# Altium schematic sheet 2-Power.SchDoc
size A4
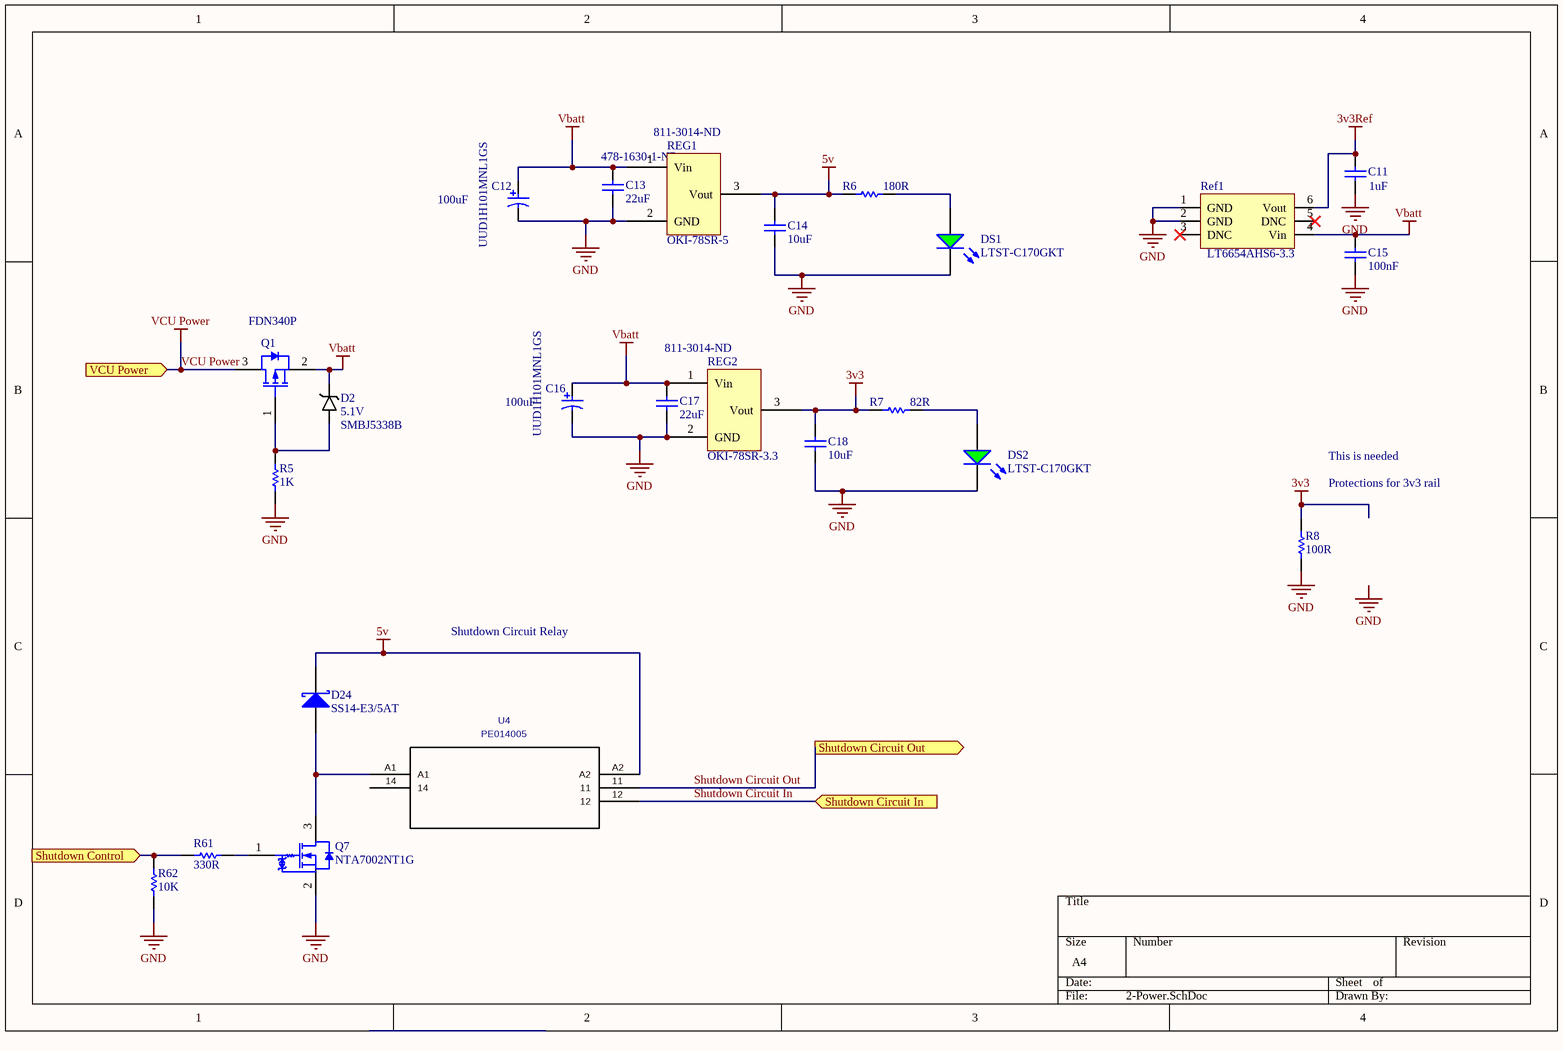
[diagram p0: 2-Power.SchDoc]

## Parts
C11  value 1uF  [1608[0603]]  (hidden comment: Cap)
C12  UUD1H101MNL1GS  [NIC-CAPA2-8X10_V]
C13  value 22uF  Supplier Part Number 1: 478-1630-1-ND  [C1210_M]  (hidden comment: Cap)
C14  value 10uF  [C1210_M]  (hidden comment: Cap)
C15  value 100nF  [1608[0603]]  (hidden comment: Cap)
C16  UUD1H101MNL1GS  [NIC-CAPA2-8X10_V]
C17  value 22uF  [C1210_M]  (hidden comment: Cap)
C18  value 10uF  [C1210_M]  (hidden comment: Cap)
D2  Reverse Voltage: 5.1V  Part Number: SMBJ5338B  [DO-214AA (SMB)]  (hidden comment: Zener Diode, 5.1V, 5W SMBJ5338B)
D24  SS14-E3/5AT  [VISH-DO-214AC-2_V]
DS1  LTST-C170GKT  [LTST-C170GKT_V]
DS2  LTST-C170GKT  [LTST-C170GKT_V]
Q1  FDN340P  [FAIR-SSOT3L-3_V]
Q7  NTA7002NT1G  [ONSC-SC-75-3-463-01_V]
R5  value 1K  [1608[0603]]  (hidden comment: Res1)
R6  value 180R  [1608[0603]]  (hidden comment: Res1)
R7  value 82R  [1608[0603]]  (hidden comment: Res1)
R8  100R  [RESC1206(3216)_M]
R61  value 330R  [1608[0603]]  (hidden comment: Res1)
R62  value 10K  [1608[0603]]  (hidden comment: Res1)
Ref1  LT6654AHS6-3.3  [TSOT-23 S6]
REG1  OKI-78SR-5  Supplier Part Number 2: 811-3014-ND  [OKI-78SR-5/1.5-W - Horizontal]
REG2  OKI-78SR-3.3  Supplier Part Number 2: 811-3014-ND  [Reg - TH, 3 pin, 100 mil Pitch, VTL]
U4  PE014005  [PE014005]

## Ports
Shutdown Circuit In (in), Shutdown Circuit Out (out), Shutdown Control (in), VCU Power (in)

## Nets
3v3: C18.2 R7.1 R8.2 REG2.3(Vout)
3v3Ref: C11.2 Ref1.6(Vout)
5v: C14.2 D24.2(K) R6.1 REG1.3(Vout) U4.A2
GND: C11.1 C12.2 C13.1 C14.1 C15.1 C16.2 C17.1 C18.1 DS1.2(K) DS2.2(K) Q7.2(S) R5.1 R8.1 R62.1 Ref1.1(GND) Ref1.2(GND) REG1.2(GND) REG2.2(GND)
Vbatt: C12.1 C13.2 C15.2 C16.1 C17.2 D2.K Q1.2(SOURCE) Ref1.4(Vin) REG1.1(Vin) REG2.1(Vin)
VCU Power: Q1.3(DRAIN) ; port VCU Power
Shutdown Circuit In: U4.12 ; port Shutdown Circuit In
Shutdown Circuit Out: U4.11 ; port Shutdown Circuit Out
Shutdown Control: R61.2 R62.2 ; port Shutdown Control
NetD2_A: D2.A Q1.1(GATE) R5.2
NetD24_1: D24.1(A) Q7.3(D) U4.A1
NetDS1_1: DS1.1(A) R6.2
NetDS2_1: DS2.1(A) R7.2
NetQ7_1: Q7.1(G) R61.1

Not connected (* = marked no-connect by the designer): Ref1 3(DNC)* 5(DNC)*; U4 14

## Notes on the sheet
- (near C12) 100uF
- (near C16) 100uF
- (near R8) Protections for 3v3 rail
- This is needed
- Shutdown Circuit Relay
- Labels drawn without touching a wire or pin: GND

## Library data of the parts
C11 = Cap: Capacitor; Manufacturer: Murata Electronics North America; Manufacturer Part Number: GRM188R61E105KA12D; Capacitance: 1µF; Tolerance: ±10%; Voltage - Rated: 25V; Temperature Coefficient: X5R; RoHS: RoHS Compliant; Category: Capacitors; Stock 1: 4259407; Pricing 1: 1=0.15, 10=0.053, 50=0.0288, 100=0.0242, 250=0.01984, 500=0.01696, 1000=0.0132 (CAD); Packaging: Cut Tape (CT); Part Status: Active; Operating Temperature: -55°C ~ 85°C; Features: -; Ratings: -; Applications: General Purpose; Mounting Type: Surface Mount, MLCC; Package / Case: 0603 (1608 Metric); Size / Dimension: 0.063" L x 0.031" W (1.60mm x 0.80mm); Height - Seated (Max): -; Thickness (Max): 0.035" (0.90mm); Lead Spacing: -; Lead Style: -; ComponentLink1URL: http://www.murata.com/~/media/webrenewal/support/library/catalog/products/capacitor/mlcc/c02e.pdf; ComponentLink1Description: http://www.murata.com/~/media/webrenewal/support/library/catalog/products/capacitor/mlcc/c02e.pdf; Supplier 1: Digi-Key; Supplier Part Number 1: 587-2400-1-ND
C12 C16 = CMP-0687-00073-1: Aluminum Electrolytic Capacitor, UD Series, Low Impedance, 100 uF, 50 V, + / - 20%, -55 to 105 degC, Chip Type, 8 x 10 mm D x L, Pb-Free, Reel; Manufacturer: Nichicon; Rated Ripple Current (at 100kHz): 300 mA; Tolerance Rated Capacitance: -20 to 20%; Packing: Dia382mm Reel; Impedance: 0.34 Ohm; Rated Voltage: 50 V; Endurance Time: 5000 h; Rated Capacitance: 100 uF; Capacitance: 100µF; Voltage Rating: 50V; Lifetime @ Temp.: 5000 Hrs @ 105°C; Polarization: Polar; Ripple Current: 300mA; Surface Mount Land Size: 0.327" L x 0.327" W (8.30mm x 8.30mm); ComponentLink3Description: Package Specification; ComponentLink2Description: Datasheet; PackageReference: CAPAE-D8H10; RoHS: TRUE; Length: 10 mm; Mounting Technology: Surface Mount; PackageDescription: 2-Pin Surface Mount Device, Diameter 8 mm, Height 10 mm, Pitch 6.5 mm; DatasheetVersion: 08/2012; Diameter: 8 mm; ComponentLink3URL: http://products.nichicon.co.jp/en/pdf/XJA043/e-ud.pdf; ComponentLink1Description: Manufacturer URL; PartNumber: UUD1H101MNL1GS; ComponentLink2URL: http://products.nichicon.co.jp/en/pdf/XJA043/e-ud.pdf; ComponentLink1URL: http://www.nichicon.co.jp/; Supplier 1: Digi-Key; Supplier Part Number 1: 493-2306-1-ND; Manufacturer Part Number: UUD1H101MNL1GS; Category: Capacitors; Stock 1: 65948; Pricing 1: 1=0.92, 10=0.685, 25=0.5868, 50=0.5478, 100=0.4696, 250=0.43044 (CAD); Packaging: Cut Tape (CT); Part Status: Active; Tolerance: ±20%; ESR (Equivalent Series Resistance): -; Operating Temperature: -55°C ~ 105°C; Applications: General Purpose; Lead Spacing: -; Size / Dimension: 0.315" Dia (8.00mm); Height - Seated (Max): 0.394" (10.00mm); Mounting Type: Surface Mount; Package / Case: Radial, Can - SMD; ComponentLink4URL: http://nichicon-us.com/english/products/pdfs/e-uud.pdf; ComponentLink4Description: http://nichicon-us.com/english/products/pdfs/e-uud.pdf
C13 C17 = Cap: Capacitor; Manufacturer: Yageo; Manufacturer Part Number: CC1210MKX5R8BB226; Capacitance: 22µF; Tolerance: ±20%; Voltage - Rated: 25V; Temperature Coefficient: X5R; RoHS: RoHS Compliant; Category: Capacitors; Stock 1: 128; Pricing 1: 1=1, 10=0.703, 25=0.5996, 50=0.5314, 100=0.4628, 250=0.39424 (CAD); Packaging: Cut Tape (CT); Part Status: Active; Operating Temperature: -55°C ~ 85°C; Features: -; Ratings: -; Applications: General Purpose; Failure Rate: -; Mounting Type: Surface Mount, MLCC; Package / Case: 1210 (3225 Metric); Size / Dimension: 0.126" L x 0.098" W (3.20mm x 2.50mm); Height - Seated (Max): -; Thickness (Max): 0.110" (2.80mm); Lead Spacing: -; Lead Style: -; ComponentLink1URL: http://www.yageo.com/documents/recent/UPY-GPHC_X5R_4V-to-50V_23.pdf; ComponentLink1Description: http://www.yageo.com/documents/recent/UPY-GPHC_X5R_4V-to-50V_23.pdf; Supplier 1: Digi-Key
  C17: Supplier Part Number 1: 311-2056-1-ND
C14 C18 = Cap: Capacitor; Manufacturer: Yageo; Manufacturer Part Number: CC1210ZKY5V8BB106; Capacitance: 10µF; Tolerance: -20%, +80%; Voltage - Rated: 25V; Temperature Coefficient: Y5V (F); Supplier 1: Digi-Key; Supplier Part Number 1: 311-2063-1-ND; RoHS: RoHS Compliant; Category: Capacitors; Stock 1: 1156; Pricing 1: 1=0.47, 10=0.323, 25=0.258, 50=0.2154, 100=0.1829, 250=0.14528, 500=0.12912, 1000=0.11298 (CAD); Packaging: Cut Tape (CT); Part Status: Active; Operating Temperature: -30°C ~ 85°C; Features: -; Ratings: -; Applications: General Purpose; Failure Rate: -; Mounting Type: Surface Mount, MLCC; Package / Case: 1210 (3225 Metric); Size / Dimension: 0.126" L x 0.098" W (3.20mm x 2.50mm); Height - Seated (Max): -; Thickness (Max): 0.083" (2.10mm); Lead Spacing: -; Lead Style: -; ComponentLink1URL: http://www.yageo.com/documents/recent/UPY-GPHC_Y5V_6.3V-to-50V_7.pdf; ComponentLink1Description: http://www.yageo.com/documents/recent/UPY-GPHC_Y5V_6.3V-to-50V_7.pdf
C15 = Cap: Capacitor; Manufacturer: Yageo; Manufacturer Part Number: CC0603KRX7R9BB104; Capacitance: 0.10µF; Tolerance: ±10%; Voltage - Rated: 50V; Temperature Coefficient: X7R; Supplier 1: Digi-Key; Supplier Part Number 1: 311-1344-1-ND; RoHS: RoHS Compliant; Category: Capacitors; Stock 1: 4016262; Pricing 1: 1=0.15, 10=0.043, 25=0.0312, 50=0.0232, 100=0.0189, 250=0.0158, 500=0.01346, 1000=0.01059 (CAD); Packaging: Cut Tape (CT); Part Status: Active; Operating Temperature: -55°C ~ 125°C; Features: -; Ratings: -; Applications: General Purpose; Failure Rate: -; Mounting Type: Surface Mount, MLCC; Package / Case: 0603 (1608 Metric); Size / Dimension: 0.063" L x 0.031" W (1.60mm x 0.80mm); Height - Seated (Max): -; Thickness (Max): 0.035" (0.90mm); Lead Spacing: -; Lead Style: -; ComponentLink1URL: http://www.yageo.com/documents/recent/UPY-GPHC_X7R_6.3V-to-50V_16.pdf; ComponentLink1Description: http://www.yageo.com/documents/recent/UPY-GPHC_X7R_6.3V-to-50V_16.pdf
D24 = CMP-0549-00004-1: Schottky Barrier Rectifier, 40 V Maximum DC Blocking Voltage, -65 to 125 degC, 2-Pin SMA Case, RoHS; Manufacturer: Vishay Semiconductor; IFSM: 40 A; IF(AV): 1 A Max.; VRRM: 40 V Max.; VRMS: 28 V Max.; PackageReference: DO-214AC-2; RoHS: TRUE; DatasheetVersion: 12/17/2012; ComponentLink1Description: Manufacturer URL; ComponentLink2URL: http://www.vishay.com/docs/88746/ss12.pdf; PartNumber: SS14-E3/5AT; PackageVersion: Dec-12; Operating Temperature: -65 to 125 degC; ComponentLink3URL: http://www.vishay.com/docs/88746/ss12.pdf; PackageDescription: 2-Pin SMD, Body 4.245 x 2.665 mm, Height 2.29 mm; ComponentLink1URL: http://www.vishay.com/; ComponentLink3Description: Package Specification; ComponentLink2Description: Datasheet; Mounting Technology: Surface Mount; VDC: 40 V Max.
DS1 DS2 = CMP-1674-00002-5: LED Uni-Color Green, 100 mW, 120 mA, -55 to 85 degC, 2-Pin SMD, RoHS, Tape and Reel; Manufacturer: Lite-On; Lens Color: Colorless; Lens Transparency: Clear; Millicandela Rating: 6mcd; Lens Style/Size: Rectangle with Flat Top, 1.40mm x 1.25mm; Voltage - Forward (Vf) (Typ): 2.1V; Current - Test: 10mA; Viewing Angle: 130°; Wavelength - Dominant: 569nm; Wavelength - Peak: 565nm; ComponentLink1URL: http://www.us.liteon.com/; Height: 1.1 mm; PackageDescription: 2-Pin Surface Mount Device, Body 2 x 1.25 mm; RoHSCompliant: true; Package Quantity: 1; Packaging: Tape and Reel; Mount: Surface Mount; Min Operating Temperature: -55 degC; DatasheetVersion: 03/2003; Max Operating Temperature: 85 degC; ComponentLink1Description: Manufacturer URL; Pins: 2; Mounting Technology: Surface Mount; Length: 2 mm; Colour: Green; PackageReference: C170GKT; ComponentLink2URL: http://media.digikey.com/pdf/Data%20Sheets/Lite-On%20PDFs/LTST-C170GKT.pdf; ComponentLink2Description: Datasheet; Supplier 1: Digi-Key; Supplier Part Number 1: 160-1179-1-ND; Manufacturer Part Number: LTST-C170GKT; RoHS: RoHS Compliant; Category: Optoelectronics; Stock 1: 242288; Pricing 1: 1=0.48, 10=0.351, 25=0.2588, 100=0.1848, 250=0.12564, 500=0.11086, 1000=0.08684 (CAD); Part Status: Active; Color: Green; Mounting Type: Surface Mount; Features: -; Package / Case: 0805 (2012 Metric); Supplier Device Package: -; Size / Dimension: 2.00mm L x 1.25mm W; Height (Max): 1.10mm
Q1 = CMP-2100-03638-1: Single P-Channel, Logic Level, PowerTrench(R) MOSFET, 2 A, 20 V, -55 to 150 degC, 3-Pin SOT-23, RoHS, Tape and Reel; Manufacturer: Fairchild Semiconductor; Fall Time: 11ns; Current Rating: -2A; Turn-On Delay Time: 10ns; Drain to Source Breakdown Voltage: -20V; Drain to Source Resistance: 60mOhm; Gate to Source Voltage (Vgs): 8V; Threshold Voltage: -800mV; Rds On Max: 70mOhm; Package Version: Rev. 3, 05/2015; Turn-Off Delay Time: 27ns; Power Dissipation: 500mW; Number of Elements: 1; Drain to Source Voltage (Vdss): 20V; Rise Time: 9ns; Input Capacitance: 779pF; Continuous Drain Current (ID): 2A; Radiation Hardening: No; Contact Plating: Tin; Mount: SurfaceMount; REACH SVHC: NoSVHC; Manufacturer URL: https://www.fairchildsemi.com/; Width: 3.05mm; Height: 0.94mm; Voltage Rating (DC): -20V; Package Quantity: 1; Case/Package: SOT-23; Package Reference: SSOT3L; Lead Free: LeadFree; Datasheet Version: Rev. E1, 02/2007; Termination: SMD/SMT; Package URL: https://www.fairchildsemi.com/package-drawings/MA/MA03B.pdf; Packaging: TapeandReel; Number of Pins: 3; RoHSCompliant: true; Datasheet URL: https://www.fairchildsemi.com/datasheets/FD/FDN340P.pdf; Max Operating Temperature: 150degC; Element Configuration: Single; Min Operating Temperature: -55degC; Length: 2.92mm; Package Description: 3-Pin Small Outline Transistor, Body 2.92 x 1.4 mm, Pitch 0.95 mm; Max Power Dissipation: 500mW
Q7 = CMP-1058-00646-1: Small Signal MOSFET, 30 V, 154 mA, Single, N-Channel, Gate ESD Protection, 3-Pin SC75, Pb-Free, Tape and Reel; Manufacturer: On Semiconductor; Coss Typ (pF): 10; Crss Typ (pF): 3.5; Ciss Typ (pF): 11.5; V(BR)DSS Min (V): 30; Channel Polarity: N Channel; VGS(th) Max (V): 1.5; PD Max (W): 0.3; ID Max (A): 0.154; PackageReference: SC-75-3-463-01; ComponentLink3Description: Package Specification; PartNumber: NTA7002NT1G; PackageDescription: 3-Pin Small Outline Transistor, Body 1.6 x 0.8 mm, Pitch 0.5 mm; ComponentLink3URL: http://www.onsemi.com/pub_link/Collateral/463-01.PDF; Package Type: SC-75-3; Packing: Tape and Reel; Configuration: Single; PackageVersion: Rev. F, 07/2005; ComponentLink2Description: Datasheet; ComponentLink1URL: http://www.onsemi.com/; ComponentLink1Description: Manufacturer URL; DatasheetVersion: Rev. 5; VGS Max (V): 10; Mounting Technology: Surface Mount; RoHS: Pb-Free; ComponentLink2URL: http://www.onsemi.cn/pub_link/Collateral/NTA7002N-D.PDF
R5 = Res1: Resistor; Manufacturer: Panasonic Electronic Components; Manufacturer Part Number: ERJ-PA3F1001V; Tolerance: ±1%; Power (Watts): 0.25W, 1/4W; Temperature Coefficient: ±100ppm/°C; Supplier 1: Digi-Key; Supplier Part Number 1: P1.0KBYCT-ND; RoHS: RoHS Compliant; Category: Resistors; Stock 1: 56110; Pricing 1: 1=0.22, 10=0.198, 25=0.138, 50=0.1072, 100=0.0765, 250=0.05972, 500=0.04746, 1000=0.03368 (CAD); Packaging: Cut Tape (CT); Part Status: Active; Resistance (Ohms): 1k; Composition: Thick Film; Features: Automotive AEC-Q200, Pulse Withstanding; Operating Temperature: -55°C ~ 155°C; Package / Case: 0603 (1608 Metric); Supplier Device Package: 0603; Size / Dimension: 0.063" L x 0.031" W (1.60mm x 0.80mm); Height - Seated (Max): 0.022" (0.55mm); Number of Terminations: 2; Failure Rate: -; ComponentLink1URL: https://industrial.panasonic.com/cdbs/www-data/pdf/RDA0000/AOA0000C243.pdf; ComponentLink1Description: https://industrial.panasonic.com/cdbs/www-data/pdf/RDA0000/AOA0000C243.pdf
R6 = Res1: Resistor; Manufacturer: Yageo; Manufacturer Part Number: RC0603JR-07180RL; Resistance (Ohms): 180; Tolerance: ±5%; Power (Watts): 0.1W, 1/10W; Temperature Coefficient: ±100ppm/°C; Supplier 1: Digi-Key; Supplier Part Number 1: 311-180GRCT-ND; RoHS: RoHS Compliant; Category: Resistors; Stock 1: 201936; Pricing 1: 1=0.16, 10=0.016, 25=0.0112, 50=0.0084, 100=0.0062, 250=0.0048, 500=0.00382, 1000=0.00281 (CAD); Packaging: Cut Tape (CT); Part Status: Active; Composition: Thick Film; Features: Moisture Resistant; Operating Temperature: -55°C ~ 155°C; Package / Case: 0603 (1608 Metric); Supplier Device Package: 0603; Size / Dimension: 0.063" L x 0.031" W (1.60mm x 0.80mm); Height - Seated (Max): 0.022" (0.55mm); Number of Terminations: 2; Failure Rate: -; ComponentLink1URL: http://www.yageo.com/NewPortal/yageodocoutput?fileName=/pdf/R-Chip/PYu-RC_Group_51_RoHS_L_4.pdf; ComponentLink1Description: http://www.yageo.com/NewPortal/yageodocoutput?fileName=/pdf/R-Chip/PYu-RC_Group_51_RoHS_L_4.pdf
R7 = Res1: Resistor; Manufacturer: Yageo; Manufacturer Part Number: RC0603JR-0782RL; Resistance (Ohms): 82; Tolerance: ±5%; Power (Watts): 0.1W, 1/10W; Temperature Coefficient: ±100ppm/°C; Supplier 1: Digi-Key; Supplier Part Number 1: 311-82GRCT-ND; RoHS: RoHS Compliant; Category: Resistors; Stock 1: 72049; Pricing 1: 1=0.16, 10=0.016, 25=0.0112, 50=0.0084, 100=0.0062, 250=0.0048, 500=0.00382, 1000=0.00281 (CAD); Packaging: Cut Tape (CT); Part Status: Active; Composition: Thick Film; Features: Moisture Resistant; Operating Temperature: -55°C ~ 155°C; Package / Case: 0603 (1608 Metric); Supplier Device Package: 0603; Size / Dimension: 0.063" L x 0.031" W (1.60mm x 0.80mm); Height - Seated (Max): 0.022" (0.55mm); Number of Terminations: 2; Failure Rate: -; ComponentLink1URL: http://www.yageo.com/NewPortal/yageodocoutput?fileName=/pdf/R-Chip/PYu-RC_Group_51_RoHS_L_4.pdf; ComponentLink1Description: http://www.yageo.com/NewPortal/yageodocoutput?fileName=/pdf/R-Chip/PYu-RC_Group_51_RoHS_L_4.pdf
R8 = CMP-1014-00050-1: 100R 0.25W 5% 1206 (3216 Metric)  SMD; Case-EIA: 1206; Value: 100.00 Ohm; Case-Metric: 3216; Tolerance: 5 %; Power: 0.25 W; Technology: SMT
R61 R62 = Res1: Resistor; Manufacturer: Panasonic Electronic Components; Manufacturer Part Number: ERJ-PA3F1001V; Resistance (Ohms): 1k; Tolerance: ±1%; Power (Watts): 0.25W, 1/4W; Temperature Coefficient: ±100ppm/°C; Supplier 1: Digi-Key; Supplier Part Number 1: P1.0KBYCT-ND; RoHS: RoHS Compliant; Category: Resistors; Stock 1: 56110; Pricing 1: 1=0.22, 10=0.198, 25=0.138, 50=0.1072, 100=0.0765, 250=0.05972, 500=0.04746, 1000=0.03368 (CAD); Packaging: Cut Tape (CT); Part Status: Active; Composition: Thick Film; Features: Automotive AEC-Q200, Pulse Withstanding; Operating Temperature: -55°C ~ 155°C; Package / Case: 0603 (1608 Metric); Supplier Device Package: 0603; Size / Dimension: 0.063" L x 0.031" W (1.60mm x 0.80mm); Height - Seated (Max): 0.022" (0.55mm); Number of Terminations: 2; Failure Rate: -; ComponentLink1URL: https://industrial.panasonic.com/cdbs/www-data/pdf/RDA0000/AOA0000C243.pdf; ComponentLink1Description: https://industrial.panasonic.com/cdbs/www-data/pdf/RDA0000/AOA0000C243.pdf
Ref1 = LT6654AHS6-3.3: Manufacturer: Linear Technology; Reference Type: Series; Output Type: Fixed; Voltage - Output (Min/Fixed): 3.3V; Current - Output: 10mA; Tolerance: ±0.05%; Temperature Coefficient: 10ppm/°C; Noise - 0.1Hz to 10Hz: 1.7ppmp-p; Noise - 10Hz to 10kHz: 2ppmrms; Voltage - Input: 3.8 V ~ 36 V; Current - Supply: 600µA; Manufacturer Part Number: LT6654AHS6-3.3; Digikey Part Number: LT6654AHS6-3.3#TRMPBFCT-ND; Digikey Link: http://www.digikey.com/product-detail/en/linear-technology/LT6654AHS6-3.3-TRMPBF/LT6654AHS6-3.3-TRMPBFCT-ND/2485839; Supplier 1: Digi-Key; Supplier Part Number 1: LT6654AHS6-3.3#TRMPBFCT-ND; RoHS: RoHS Compliant; Category: Integrated Circuits (ICs); Stock 1: 1315; Pricing 1: 1=9.53, 25=8.508, 100=5.5596, 250=5.1048 (CAD); Packaging: Cut Tape (CT); Part Status: Active; Voltage - Output (Max): -; Current - Cathode: -; Operating Temperature: -40°C ~ 125°C (TA); Mounting Type: Surface Mount; Package / Case: SOT-23-6 Thin, TSOT-23-6; Supplier Device Package: TSOT-23-6; ComponentLink1URL: http://www.linear.com/docs/29677; ComponentLink1Description: http://www.linear.com/docs/29677
REG1 = OKI-78SR-5: 5V DCDC; Manufacturer: Murata Power Solutions Inc.; Manufacturer Part Number: OKI-78SR-3.3/1.5-W36H-C; Power (Watts) - Manufacture Series: 5W; Number of Outputs: 1; Voltage - Input (Min): 7V; Voltage - Input (Max): 36V; Current - Output (Max): 1.5A; Efficiency: 85.5%; Supplier 1: Digi-Key; Supplier Part Number 1: 811-2196-5-ND; Supplier 2: Digi-Key; RoHS: RoHS Compliant; Category: Power Supplies - Board Mount; Stock 2: 4108; Pricing 2: 1=6.31, 5=6.248, 10=6.205, 25=6.1168, 50=5.9262, 100=5.5449, 250=5.28716 (CAD); Packaging: Tray; Part Status: Active; Type: Linear Regulator Replacement; Voltage - Output 1: 5V; Voltage - Output 2: -; Voltage - Output 3: -; Voltage - Isolation: -; Applications: ITE (Commercial); Features: SCP; Mounting Type: Through Hole; Package / Case: 3-SIP Module; Size / Dimension: 0.65" L x 0.41" W x 0.30" H (16.5mm x 10.4mm x 7.6mm); Operating Temperature: -40°C ~ 85°C; ComponentLink1URL: http://power.murata.com/data/power/oki-78sr.pdf; ComponentLink1Description: http://power.murata.com/data/power/oki-78sr.pdf
REG2 = OKI-78SR-5: 3.3V DCDC; Manufacturer: Murata Power Solutions Inc.; Manufacturer Part Number: OKI-78SR-3.3/1.5-W36H-C; Power (Watts) - Manufacture Series: 5W; Number of Outputs: 1; Voltage - Input (Min): 7V; Voltage - Input (Max): 36V; Current - Output (Max): 1.5A; Efficiency: 85.5%; Supplier 1: Digi-Key; Supplier Part Number 1: 811-2196-5-ND; Supplier 2: Digi-Key; RoHS: RoHS Compliant; Category: Power Supplies - Board Mount; Stock 2: 4108; Pricing 2: 1=6.31, 5=6.248, 10=6.205, 25=6.1168, 50=5.9262, 100=5.5449, 250=5.28716 (CAD); Packaging: Tray; Part Status: Active; Type: Linear Regulator Replacement; Voltage - Output 1: 3.3V; Voltage - Output 2: -; Voltage - Output 3: -; Voltage - Isolation: -; Applications: ITE (Commercial); Features: SCP; Mounting Type: Through Hole; Package / Case: 3-SIP Module; Size / Dimension: 0.65" L x 0.41" W x 0.30" H (16.5mm x 10.4mm x 7.6mm); Operating Temperature: -40°C ~ 85°C; ComponentLink1URL: http://power.murata.com/data/power/oki-78sr.pdf; ComponentLink1Description: http://power.murata.com/data/power/oki-78sr.pdf
U4 = PE014005: Mfr_Name: Tyco Electronics; Value: PE014005; Copyright: Copyright (C) 2021 Ultra Librarian. All rights reserved.; Manufacturer_Part_Number: PE014005; Digi-Key_Part_Number_1: PB353-ND; Digi-Key_Part_Number_2: PB353-NDL
D2 = Zener Diode, 5.1V, 5W SMBJ5338B: Power: 5W